# EAGLE design Nixie board (EAGLE 7.7.0)
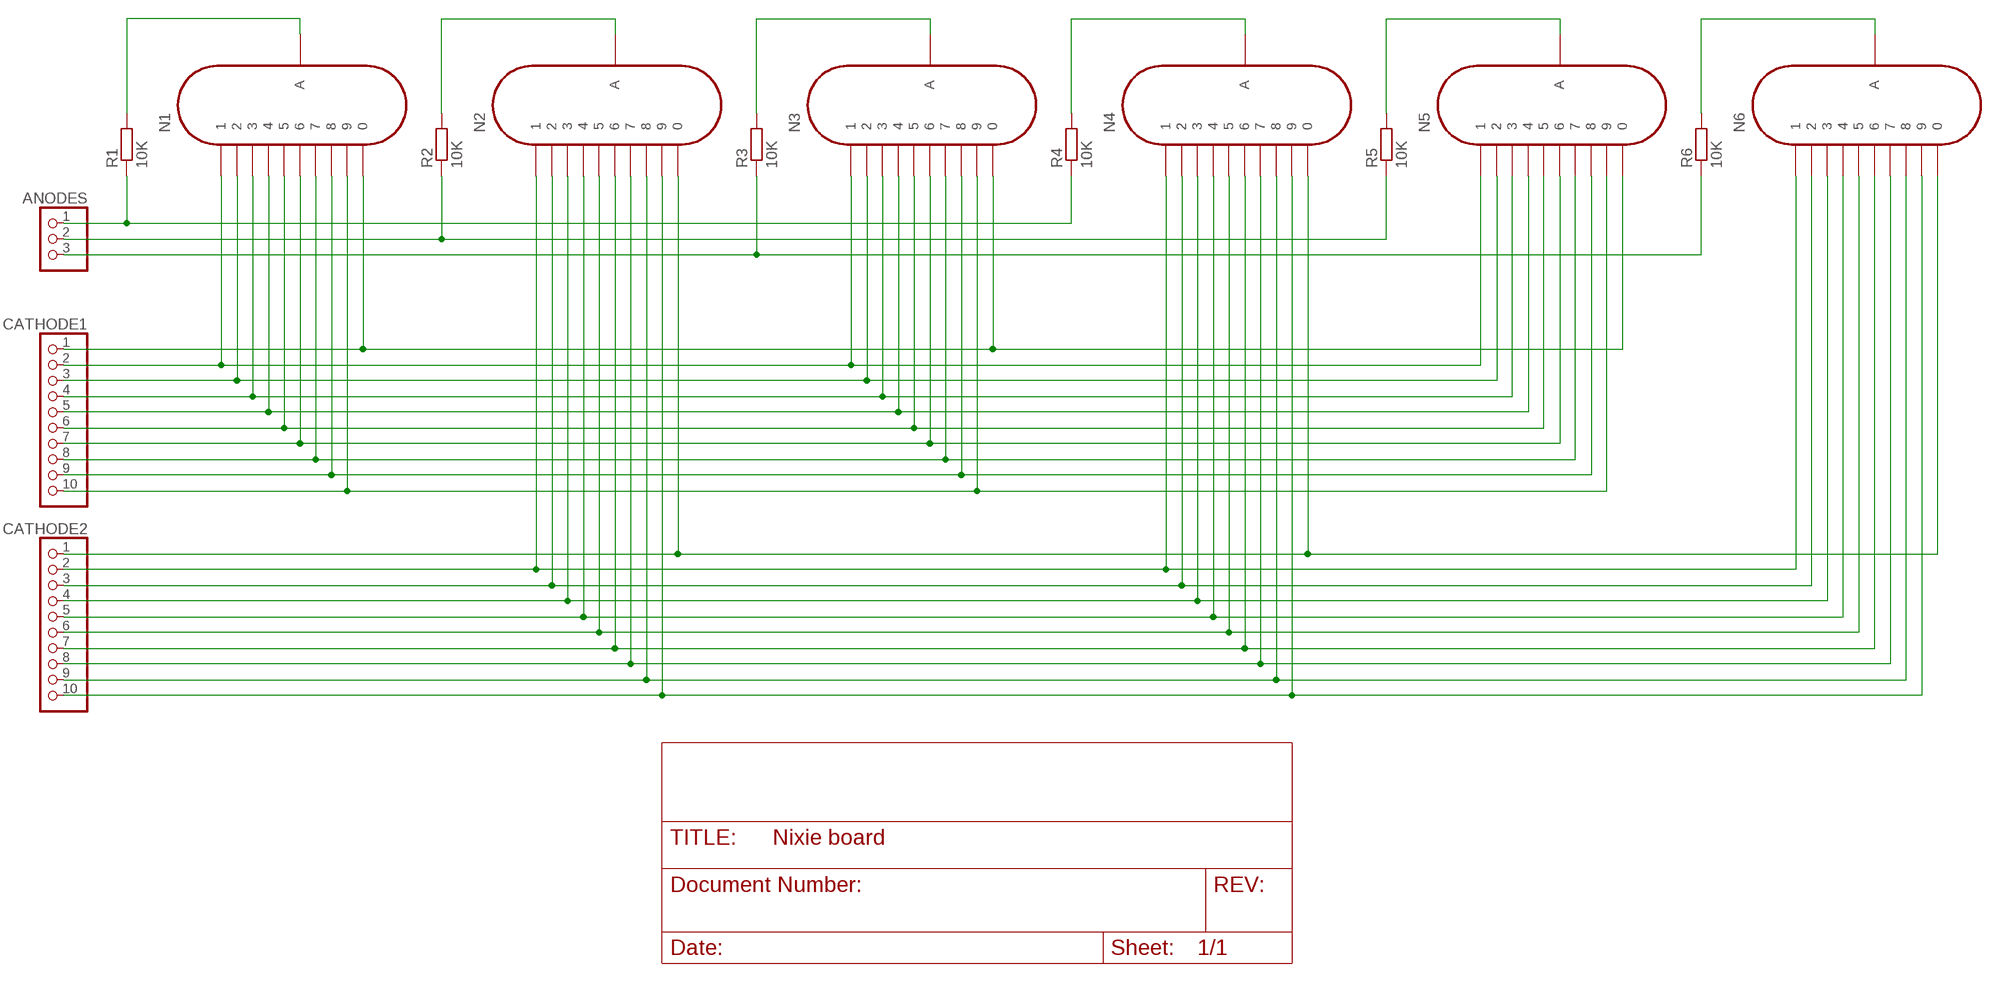
[diagram p0: schematic, sheet 1]

## Parts
ANODES  PINHD-1X3  [1X03]
CATHODE1  PINHD-1X10  [1X10]
CATHODE2  PINHD-1X10  [1X10]
N1  IN-12A  [IN-12]
N2  IN-12A  [IN-12]
N3  IN-12A  [IN-12]
N4  IN-12A  [IN-12]
N5  IN-12A  [IN-12]
N6  IN-12A  [IN-12]
R1  10K  R-EU_0207/10  [0207/10]
R2  10K  R-EU_0207/10  [0207/10]
R3  10K  R-EU_0207/10  [0207/10]
R4  10K  R-EU_0207/10  [0207/10]
R5  10K  R-EU_0207/10  [0207/10]
R6  10K  R-EU_0207/10  [0207/10]

## Nets
N$1: N1.A R1.2
N$2: ANODES.1 R1.1 R4.1
N$3: N4.A R4.2
N$4: ANODES.2 R2.1 R5.1
N$5: N5.A R5.2
N$6: N2.A R2.2
N$7: ANODES.3 R3.1 R6.1
N$8: N6.A R6.2
N$9: N3.A R3.2
N$10: CATHODE1.1 N1.0 N3.0 N5.0
N$11: CATHODE1.2 N1.1 N3.1 N5.1
N$12: CATHODE1.3 N1.2 N3.2 N5.2
N$13: CATHODE1.4 N1.3 N3.3 N5.3
N$14: CATHODE1.5 N1.4 N3.4 N5.4
N$15: CATHODE1.6 N1.5 N3.5 N5.5
N$16: CATHODE1.7 N1.6 N3.6 N5.6
N$17: CATHODE1.8 N1.7 N3.7 N5.7
N$18: CATHODE1.9 N1.8 N3.8 N5.8
N$19: CATHODE1.10 N1.9 N3.9 N5.9
N$20: CATHODE2.1 N2.0 N4.0 N6.0
N$21: CATHODE2.2 N2.1 N4.1 N6.1
N$22: CATHODE2.3 N2.2 N4.2 N6.2
N$23: CATHODE2.4 N2.3 N4.3 N6.3
N$24: CATHODE2.5 N2.4 N4.4 N6.4
N$25: CATHODE2.6 N2.5 N4.5 N6.5
N$26: CATHODE2.7 N2.6 N4.6 N6.6
N$27: CATHODE2.8 N2.7 N4.7 N6.7
N$28: CATHODE2.9 N2.8 N4.8 N6.8
N$29: CATHODE2.10 N2.9 N4.9 N6.9

## Library data of the parts
ANODES = pinhead:PINHD-1X3: PIN HEADER
CATHODE1 CATHODE2 = pinhead:PINHD-1X10: PIN HEADER
N1-N6 = russian-nixies:IN-12A: IN-12A: medium numeric topview nixie tube
R1-R6 = rcl:R-EU_: RESISTOR, European symbol

## Board
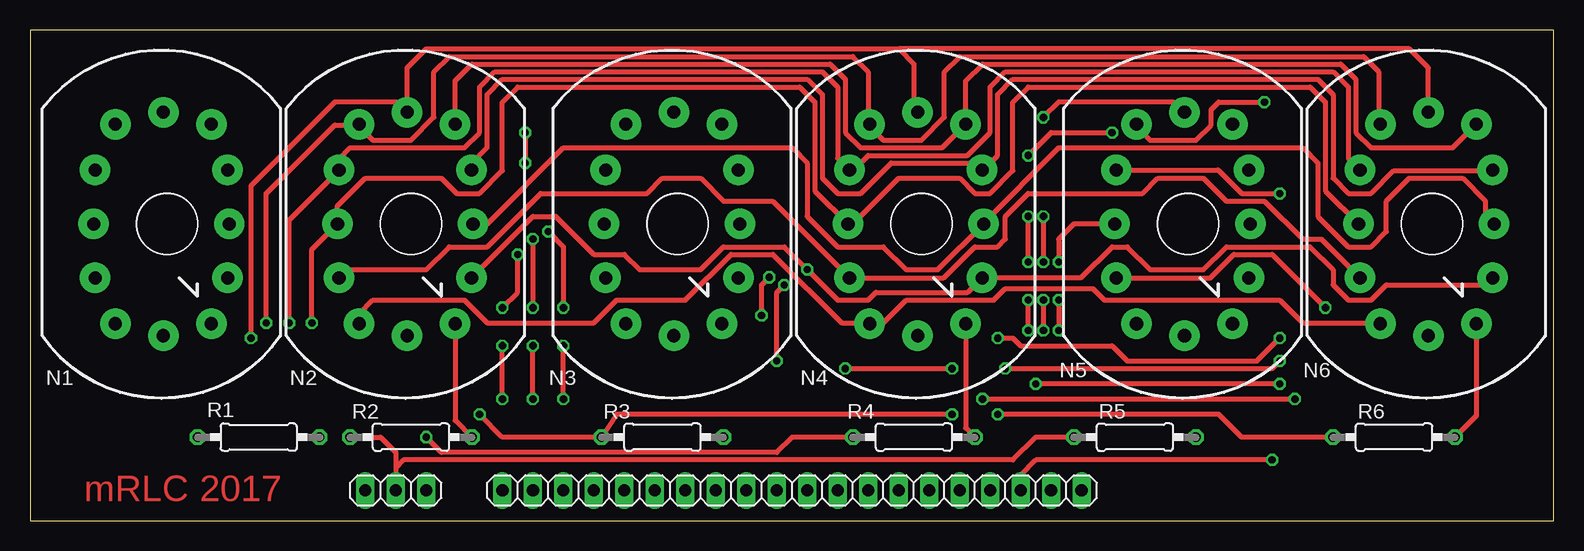
[diagram p1: board, top side]
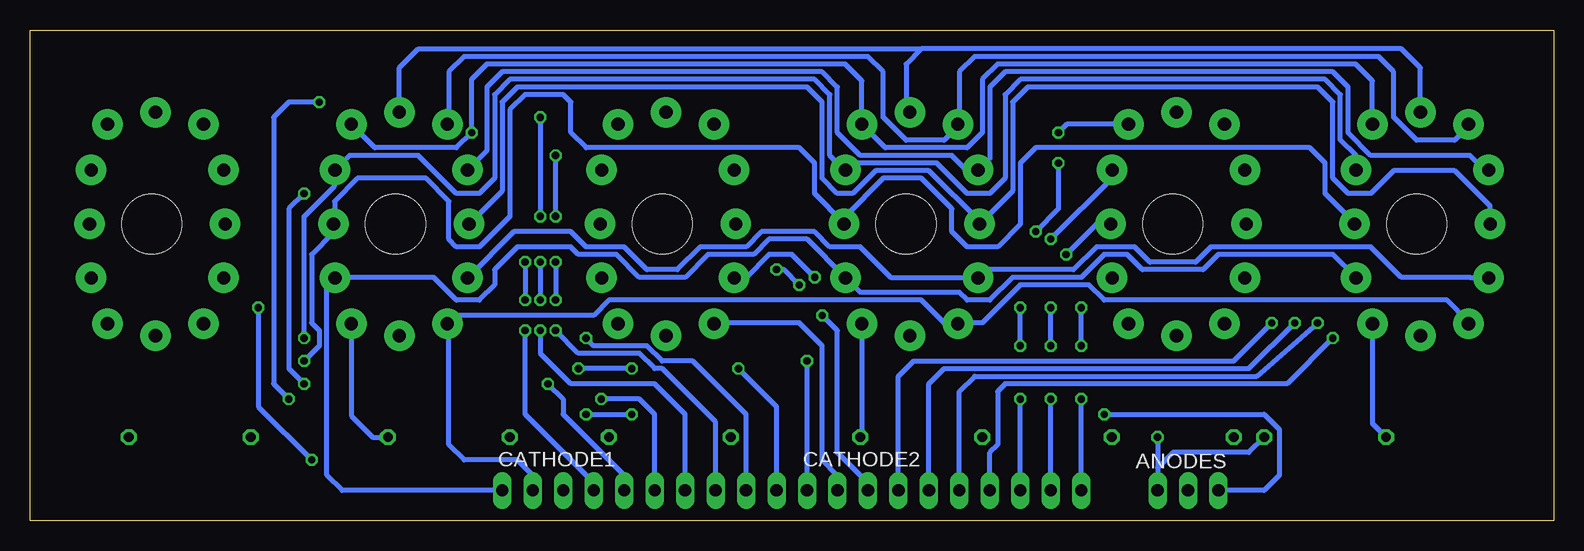
[diagram p2: board, bottom side, seen from below]

Size 126.98 x 40.95 mm. Coordinates in mm from the lower left corner, seen from the top.
Outline: 0,0 126.98,0 126.98,40.95 0,40.95 0,0
Copper layers (1*16): Top 0.035mm / dielectric 1.5mm / Bottom 0.035mm
Design rules "default": minimum track width 10mil, minimum drill 24mil, track to track 8mil, track to pad 8mil, pad to pad 8mil, via to via 8mil, smd to smd 8mil, copper to edge 40mil, drill to drill 8mil, minimum pad ring 10mil, minimum via ring 8mil, stop-mask expansion 4mil, vias tented up to drill 0mil, thermal gap 10mil

### Footprints (pad centres in the part's own frame; a part is rotated, then mirrored left to right if it is on the bottom)
1X03 = drill 1.016 long: 1 -2.54,0; 2 0,0; 3 2.54,0
1X10 = drill 1.016 long: 1 -11.43,0; 2 -8.89,0; 3 -6.35,0; 4 -3.81,0; 5 -1.27,0; 6 1.27,0; 7 3.81,0; 8 6.35,0; 9 8.89,0; 10 11.43,0
IN-12 = drill 1.1 pad 2.54: 0 5.048,-4.5; 1 -4.317,-8.318; 2 -6,-4.5; 3 -6.127,0; 4 -6,4.5; 5 -4.317,8.318; 6 -0.318,9.318; 7 3.683,8.318; 8 5.048,4.5; 9 5.175,0; A 3.683,-8.318; LHDP -0.318,-9.318 | hole 5: 0,0
0207/10 = drill 0.813 octagon: 1 -5.08,0; 2 5.08,0

### Placement (x,y rotation side)
ANODES  30.48,2.54 180 top
CATHODE1  76.2,2.54 180 top
CATHODE2  50.8,2.54 180 top
N1  11.43,24.77 0 top
N2  31.75,24.77 0 top
N3  53.98,24.77 0 top
N4  74.3,24.77 0 top
N5  96.52,24.77 0 top
N6  116.84,24.77 0 top
R1  19.05,6.99 180 top
R2  31.75,6.99 0 top
R3  52.7,6.99 0 top
R4  73.66,6.99 0 top
R5  92.08,6.99 0 top
R6  113.67,6.99 0 top

### Tracks (layer width: path | path; a pad name or v marks a point on that pad's centre or on a via)
N$1
  Bottom 0.406: N1.A 15.11,8.13 R1.2
N$2  (via drill 0.6)
  Top 0.406: R4.1 63.5,6.99 62.23,5.71 34.29,5.71 v33.02,6.99
  Bottom 0.406: R1.1 25.4,5.71 31.75,5.71 33.02,4.45 | 33.02,4.45 33.02,3.17 ANODES.1 | v33.02,6.99 33.02,4.45
N$3
  Top 0.406: N4.A 77.98,7.75 R4.2
N$4
  Top 0.406: R2.1 29.21,6.99 30.48,5.71 30.48,4.45 | 30.48,4.45 ANODES.2 | R5.1 83.82,6.99 81.92,5.08 31.11,5.08 30.48,4.45
N$5
  Bottom 0.406: N5.A 100.2,8.76 98.42,6.99 R5.2
N$6
  Top 0.406: N2.A 35.43,8.38 R2.2
N$7  (via drill 0.6)
  Top 0.406: R6.1 100.97,6.99 99.06,8.89 v80.64,8.89 | 66.04,8.89 v76.83,8.89 48.9,8.89 R3.1 39.37,6.99 v37.47,8.89
  Bottom 0.406: v80.64,8.89 v76.83,8.89 | v37.47,8.89 24.13,8.89 22.86,7.62 22.86,3.81 24.13,2.54 ANODES.3
N$8
  Top 0.406: N6.A 120.52,8.76 R6.2
N$9
  Bottom 0.406: N3.A 57.66,7.75 R3.2
N$10
  Bottom 0.406: N1.0 16.48,20.29 18.41,22.23 27.94,22.23 29.21,20.95 34.29,20.95 35.56,22.23 37.47,22.23 39.37,20.32 45.09,20.32 46.99,18.41 48.9,18.41 49.53,19.05 57.81,19.05 N3.0 59.02,20.29 62.23,23.5 65.41,23.5 66.67,22.23 70.48,22.23 72.39,20.32 76.2,20.32 78.11,22.23 81.28,22.23 81.92,22.86 86.36,22.86 88.27,20.95 88.27,19.68 89.53,18.41 91.44,18.41 93.34,20.32 101.51,20.32 N5.0 102.23,19.6 102.23,3.81 100.97,2.54 CATHODE1.1
N$11
  Bottom 0.406: N1.1 7.11,16.64 8.89,18.41 37.47,18.41 38.73,19.68 44.45,19.68 47.62,16.51 49.59,16.51 N3.1 50.74,16.45 52.7,18.41 78.74,18.41 80.01,17.14 91.5,17.14 N5.1 | 92.14,16.51 N5.1 | CATHODE1.2 85.09,3.81 86.36,5.08 90.81,5.08 92.08,6.35 92.08,16.32 N5.1
N$12  (via drill 0.6)
  Top 0.406: CATHODE1.3 82.55,3.81 83.82,5.08 v103.5,5.08 | N5.2 98.37,20.27 100.33,22.23 103.5,22.23 v107.95,17.78
  Bottom 0.406: N1.2 6.93,20.27 6.99,20.32 12.7,20.32 15.24,22.86 28.57,22.86 29.84,21.59 33.66,21.59 34.92,22.86 38.1,22.86 40.01,20.95 47.28,20.95 N3.2 55.19,20.27 57.78,22.86 60.33,22.86 61.59,24.13 66.04,24.13 67.31,22.86 71.12,22.86 73.03,20.95 75.56,20.95 77.47,22.86 80.64,22.86 81.92,24.13 86.66,24.13 N5.2 | v107.95,17.78 107.95,9.53 v103.5,5.08
N$13  (via drill 0.6)
  Top 0.406: N5.3 87,24.77 85.72,23.5 v85.72,21.59 | v85.72,18.41 v85.72,15.88
  Bottom 0.406: N1.3 5.3,26.26 8.26,29.21 13.34,29.21 15.24,27.3 17.14,27.3 18.41,28.57 18.41,34.92 19.68,36.2 43.81,36.2 45.09,34.92 45.09,27.53 N3.3 47.85,24.99 52.07,29.21 56.52,29.21 58.42,27.3 59.69,27.3 60.96,28.57 60.96,34.92 62.23,36.2 86.36,36.2 87.63,34.92 87.63,27.53 N5.3 | CATHODE1.4 80.01,3.17 85.72,8.89 v85.72,15.88 | v85.72,21.59 v85.72,18.41
N$14  (via drill 0.6)
  Top 0.406: N5.4 99,29.27 100.97,27.3 v104.14,27.3 | v104.14,11.43 v83.82,11.43
  Bottom 0.406: N5.4 88.9,30.89 88.9,36.2 87.63,37.47 60.96,37.47 59.69,36.2 59.69,32.38 57.78,30.48 50.16,30.48 48.95,29.27 N3.4 46.99,30.25 46.99,36.2 45.72,37.47 18.41,37.47 17.14,36.2 17.14,32.38 15.24,30.48 6.99,30.48 5.77,29.27 N1.4 | v104.14,27.3 105.41,26.04 105.41,12.7 v104.14,11.43 | CATHODE1.5 77.47,3.81 82.55,8.89 82.55,10.16 v83.82,11.43
N$15  (via drill 0.6)
  Top 0.406: N5.5 92.2,32.89 93.34,31.75 97.16,31.75 98.42,33.02 98.42,34.29 99.06,34.92 v102.87,34.92 | v79.38,10.16 v105.41,10.16
  Bottom 0.406: N1.5 7.11,32.89 8.26,31.75 11.43,31.75 13.34,33.66 13.34,37.47 14.61,38.73 48.26,38.73 49.53,37.47 49.53,33.21 N3.5 49.66,32.89 50.8,31.75 53.98,31.75 55.88,33.66 55.88,37.47 57.15,38.73 90.81,38.73 92.08,37.47 92.08,33.21 N5.5 | v102.87,34.92 105.41,34.92 106.68,33.66 106.68,11.43 v105.41,10.16 | CATHODE1.6 74.93,8.89 76.2,10.16 v79.38,10.16
N$16  (via drill 0.6)
  Top 0.406: N5.6 96.09,34.08 95.25,34.92 85.72,34.92 v84.45,33.66 | v84.45,25.4 v84.45,21.59 | v84.45,18.41 v84.45,15.88
  Bottom 0.406: N1.6 11.11,37.78 12.7,39.37 52.7,39.37 | 52.7,39.37 53.98,38.1 53.98,34.4 N3.6 | N5.6 96.2,37.78 94.61,39.37 52.7,39.37 | CATHODE1.7 72.39,8.89 74.93,11.43 81.92,11.43 84.45,13.97 v84.45,15.88 | v84.45,33.66 v84.45,25.4 | v84.45,21.59 v84.45,18.41
N$17  (via drill 0.6)
  Top 0.406: v83.19,21.59 v83.19,25.4 | v83.19,30.48 85.09,32.38 v90.17,32.38 | v83.19,15.88 v83.19,18.41
  Bottom 0.406: N1.7 15.11,36.7 16.51,38.1 46.35,38.1 47.62,36.83 47.62,32.38 48.9,31.11 55.69,31.11 N3.7 57.66,36.7 59.05,38.1 88.9,38.1 90.17,36.83 v90.17,32.38 91.44,31.11 98.23,31.11 N5.7 | CATHODE1.8 69.85,8.26 74.3,12.7 74.93,12.7 76.2,13.97 81.28,13.97 v83.19,15.88 | v83.19,25.4 v83.19,30.48 | v83.19,21.59 v83.19,18.41
N$18  (via drill 0.6)
  Top 0.406: v104.14,15.24 102.23,13.34 91.44,13.34 90.17,14.61 82.55,14.61 81.92,15.24 v80.64,15.24
  Bottom 0.406: N1.8 16.48,30.45 17.78,31.75 17.78,35.56 19.05,36.83 44.45,36.83 45.72,35.56 45.72,28.57 46.99,27.3 48.9,27.3 51.44,29.84 58.44,29.84 N3.8 59.02,29.18 60.33,30.48 60.33,35.56 61.59,36.83 87,36.83 88.27,35.56 88.27,28.57 89.53,27.3 91.44,27.3 94.61,30.48 100.35,30.48 N5.8 101.6,29.23 101.6,27.94 104.14,25.4 v104.14,15.24 | CATHODE1.9 67.31,8.89 71.75,13.34 74.3,13.34 75.56,14.61 80.01,14.61 v80.64,15.24
N$19  (via drill 0.6)
  Top 0.406: v67.94,12.7 v76.83,12.7 | v81.28,12.7 103.5,12.7 v104.14,13.34
  Bottom 0.406: N1.9 16.61,24.86 19.05,27.3 19.05,29.84 20.32,31.11 43.18,31.11 44.45,29.84 44.45,24.77 46.35,22.86 48.9,22.86 50.16,24.13 50.16,26.04 52.7,28.57 55.88,28.57 59.05,25.4 59.05,24.86 N3.9 59.15,24.86 61.59,27.3 61.59,29.84 62.87,31.11 80.64,31.11 81.92,32.38 81.92,34.92 82.55,35.56 85.72,35.56 87,34.29 87,25.4 89.53,22.86 91.44,22.86 92.08,23.5 92.08,26.67 93.98,28.57 99.69,28.57 101.6,26.67 101.6,24.86 N5.9 101.69,24.04 103.5,22.23 103.5,16.51 102.87,15.88 102.87,14.61 v104.14,13.34 | CATHODE1.10 64.77,9.53 v67.94,12.7 | v76.83,12.7 v81.28,12.7
N$20  (via drill 0.6)
  Top 0.406: N2.0 36.8,20.29 41.91,25.4 43.81,25.4 46.99,22.23 49.53,22.23 50.8,20.95 55.88,20.95 57.78,22.86 62.87,22.86 v64.77,20.95 67.31,18.41 69.85,18.41 70.48,19.05 78.13,19.05 N4.0 79.34,20.29 87.6,20.29 90.17,22.86 91.44,22.86 93.34,20.95 97.79,20.95 99.69,22.86 106.68,22.86 108.58,20.95 108.58,19.68 109.86,18.41 111.76,18.41 113.03,19.68 121.31,19.68 N6.0 | v62.23,13.34 62.23,19.05 v62.87,19.68
  Bottom 0.406: CATHODE2.1 v62.23,13.34 | v62.87,19.68 64.14,20.95 v64.77,20.95
N$21
  Top 0.406: N2.1 27.43,17.27 28.57,18.41 36.2,18.41 38.1,16.51 46.99,16.51 48.9,18.41 54.61,18.41 58.42,22.23 61.91,22.23 67.63,16.51 69.92,16.51 N4.1 71.06,16.45 73.03,18.41 80.33,18.41 81.28,19.37 88.58,19.37 89.53,18.41 104.14,18.41 106.05,16.51 112.46,16.51 N6.1
  Bottom 0.406: N4.1 69.92,16.51 62.87,16.51 60.96,14.61 60.96,5.08 59.69,3.81 CATHODE2.2
N$22  (via drill 0.6)
  Top 0.406: N6.2 107.61,23.5 106.05,23.5 102.87,26.67 99.69,26.67 97.79,28.57 93.98,28.57 92.71,27.3 83.19,27.3 81.28,25.4 81.28,23.5 80.64,22.86 78.74,22.86 76.14,20.27 N4.2 61.89,26.67 57.78,26.67 55.88,28.57 52.7,28.57 51.44,27.3 42.55,27.3 38.1,22.86 34.92,22.86 33.02,20.95 26.67,20.95 25.98,20.27 N2.2 | v60.96,17.14 60.96,19.68 v61.59,20.32
  Bottom 0.406: CATHODE2.3 57.15,3.17 59.69,5.71 59.69,15.88 v60.96,17.14 | v61.59,20.32 63.5,22.23 65.41,22.23 67.31,20.32 68.24,20.32 N4.2
N$23  (via drill 0.6)
  Top 0.406: N6.3 107.95,27.53 107.95,34.92 106.68,36.2 83.19,36.2 81.92,34.92 81.92,29.21 80.01,27.3 78.74,27.3 77.47,28.57 72.39,28.57 68.58,24.77 N4.3 65.41,27.53 65.41,34.92 64.14,36.2 40.64,36.2 39.37,34.92 39.37,29.21 37.47,27.3 35.56,27.3 34.29,28.57 27.94,28.57 25.62,26.26 N2.3 23.5,22.64 v23.5,16.51
  Bottom 0.406: CATHODE2.4 54.61,12.06 53.34,13.34 26.67,13.34 v23.5,16.51
N$24  (via drill 0.6)
  Top 0.406: N6.4 109.86,30.25 109.86,36.2 108.58,37.47 81.28,37.47 80.01,36.2 80.01,32.38 78.11,30.48 69.85,30.48 68.64,29.27 N4.4 67.31,30.25 67.31,36.2 66.04,37.47 38.73,37.47 37.47,36.2 37.47,32.38 36.2,31.11 26.67,31.11 25.75,30.2 N2.4 21.59,25.11 v21.59,16.51
  Bottom 0.406: CATHODE2.5 52.07,11.43 50.8,12.7 25.4,12.7 v21.59,16.51
N$25  (via drill 0.6)
  Top 0.406: N6.5 112.39,33.21 112.39,37.47 111.12,38.73 77.47,38.73 76.2,37.47 76.2,33.66 74.3,31.75 71.12,31.75 69.98,32.89 N4.5 69.85,33.21 69.85,37.47 68.58,38.73 34.92,38.73 33.66,37.47 33.66,33.66 31.75,31.75 28.57,31.75 27.43,32.89 N2.5 27.37,33.02 25.4,33.02 19.68,27.3 v19.68,16.51
  Bottom 0.406: CATHODE2.6 49.53,10.79 48.26,12.06 24.77,12.06 v19.68,16.51
N$26  (via drill 0.6)
  Top 0.406: 72.39,39.37 33.02,39.37 31.43,37.78 N2.6 31.32,34.08 30.48,34.92 25.4,34.92 18.41,27.94 v18.41,15.24 | 72.39,39.37 73.66,38.1 73.66,34.4 N4.6 | N6.6 116.52,37.78 114.94,39.37 72.39,39.37
  Bottom 0.406: CATHODE2.7 46.99,5.71 46.35,6.35 46.35,10.79 45.72,11.43 22.23,11.43 v18.41,15.24
N$27  (via drill 0.6)
  Top 0.406: N2.7 35.43,36.7 36.83,38.1 66.67,38.1 67.94,36.83 67.94,32.38 69.22,31.11 76.01,31.11 N4.7 77.98,36.7 79.38,38.1 109.22,38.1 110.49,36.83 110.49,32.38 111.76,31.11 118.56,31.11 N6.7 | v44.45,10.16 v44.45,14.61 | v41.27,32.38 v41.27,29.84 | v43.18,24.13 44.45,22.86 v44.45,17.78
  Bottom 0.406: CATHODE2.8 v44.45,10.16 | v44.45,14.61 v44.45,17.78 | N2.7 40.58,33.08 v41.27,32.38 | v41.27,29.84 41.27,26.04 v43.18,24.13
N$28  (via drill 0.6)
  Top 0.406: N2.8 36.8,29.81 38.1,31.11 38.1,35.56 39.37,36.83 64.77,36.83 66.04,35.56 66.04,28.57 67.31,27.3 69.22,27.3 71.75,29.84 78.76,29.84 N4.8 79.34,29.18 80.64,30.48 80.64,35.56 81.92,36.83 107.31,36.83 108.58,35.56 108.58,28.57 109.86,27.3 111.76,27.3 113.67,29.21 121.83,29.21 N6.8 | v41.91,10.16 v41.91,14.61 | v41.91,23.5 v41.91,17.78
  Bottom 0.406: CATHODE2.9 v41.91,10.16 | v41.91,14.61 v41.91,17.78 | N2.8 36.8,28.61 v41.91,23.5
N$29  (via drill 0.6)
  Top 0.406: 121.92,24.86 N6.9 121.28,25.49 121.28,26.67 119.38,28.57 114.94,28.57 113.03,26.67 113.03,24.13 111.76,22.86 109.86,22.86 107.31,25.4 107.31,29.84 106.05,31.11 85.72,31.11 79.47,24.86 N4.9 75.66,20.95 73.03,20.95 71.12,22.86 67.31,22.86 64.77,25.4 64.77,29.84 63.5,31.11 44.45,31.11 38.1,24.77 N2.9 | v39.37,10.16 v39.37,14.61 | v39.37,17.78 40.64,19.05 v40.64,22.23
  Bottom 0.406: CATHODE2.10 v39.37,10.16 | v39.37,14.61 v39.37,17.78 | N2.9 38.1,24.77 v40.64,22.23

### Text on the board
Top: mRLC 2017